# Altium schematic sheet Dig_Board1.SchDoc: CSN Detector V5
size A4; Author: RCP; DrawnBy: RCP; Address1: LIM-HGGM; Address3: RCP; DocumentNumber: 1; Revision: 1; SheetNumber: 1; SheetTotal: 2; PageSetup: Record=PageOptions|CenterHorizontal=True|CenterVertical=True|PrintScale=0.97|XCorrection=1.00|YCorrection=1.00|PrintKind=0|BorderSize=5000000|LeftOffset=0|BottomOffset=0|Orientation=2|PaperLength=2970|PaperWidth=2100|Scale=100|PaperSource=7|PrintQuality=600|MediaType=1|DitherType=10|PaperKind=A4|PrintScaleMode=1
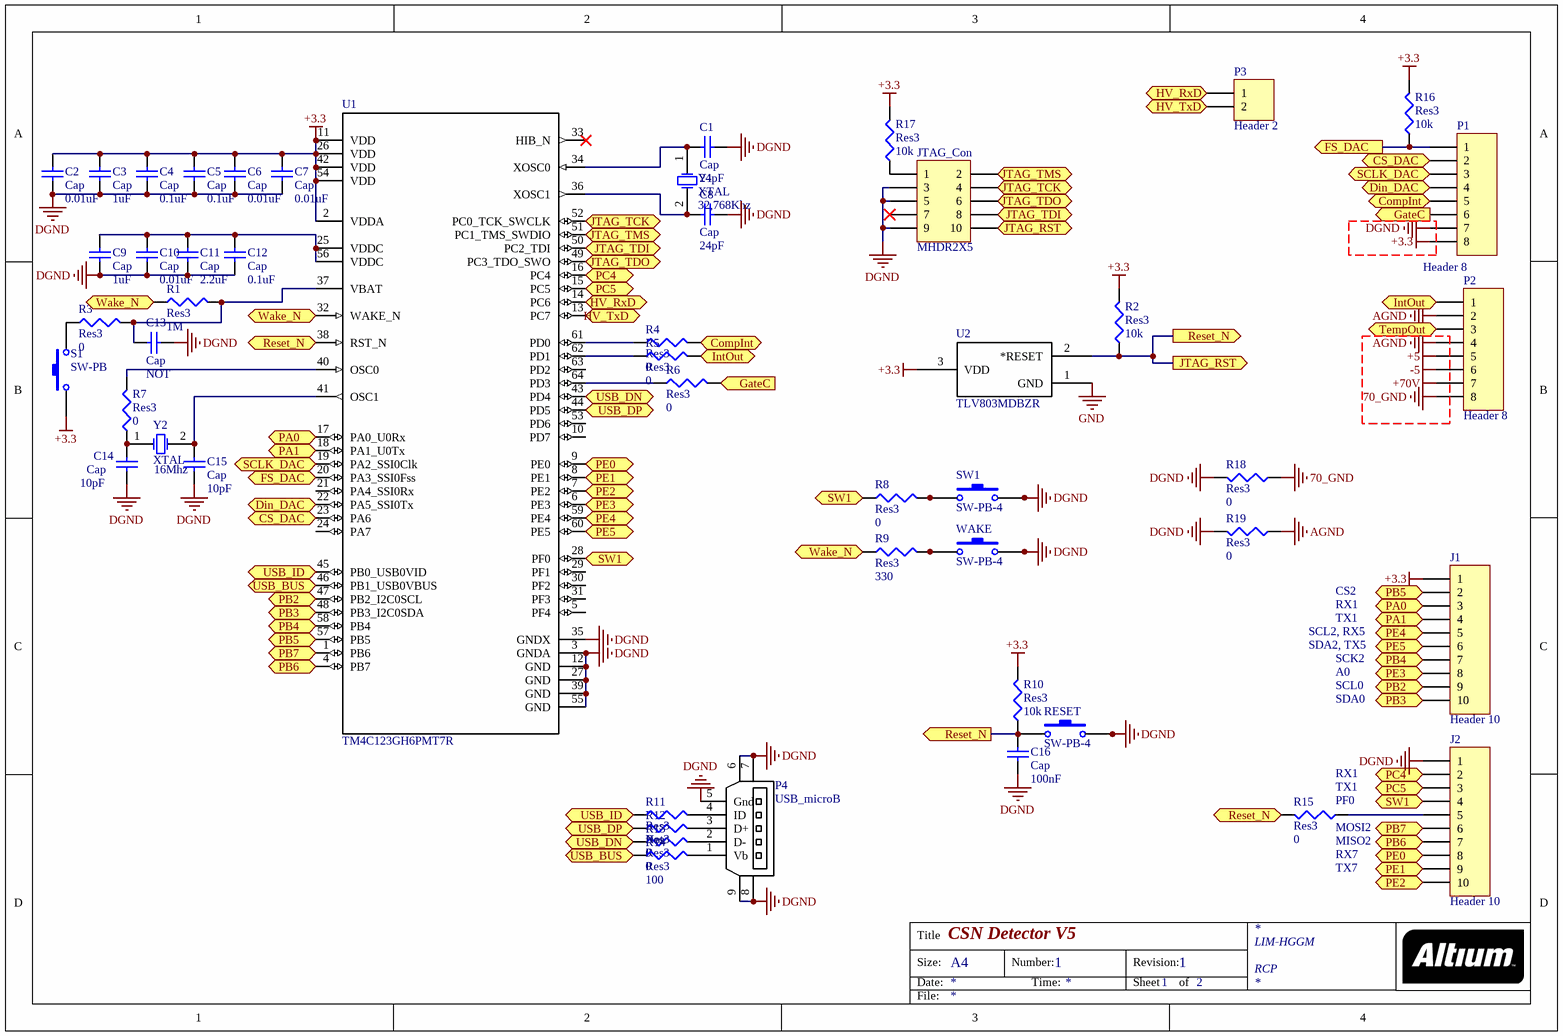
[diagram p0: Dig_Board1.SchDoc]

## Parts
C1  Cap  value 24pF  [1608[0603]]
C2  Cap  value 0.01uF  [1608[0603]]
C3  Cap  value 1uF  [1608[0603]]
C4  Cap  value 0.1uF  [1608[0603]]
C5  Cap  value 0.1uF  [1608[0603]]
C6  Cap  value 0.01uF  [1608[0603]]
C7  Cap  value 0.01uF  [1608[0603]]
C8  Cap  value 24pF  [1608[0603]]
C9  Cap  value 1uF  [1608[0603]]
C10  Cap  value 0.01uF  [1608[0603]]
C11  Cap  value 2.2uF  [1608[0603]]
C12  Cap  value 0.1uF  [1608[0603]]
C13  Cap  value NOT  [1608[0603]]
C14  Cap  value 10pF  [1608[0603]]
C15  Cap  value 10pF  [1608[0603]]
C16  Cap  value 100nF  [1608[0603]]
J1  Header 10  [HDR1X10]
J2  Header 10  [HDR1X10]
JTAG_Con  MHDR2X5  [MHDR2X5]
P1  Header 8  [HDR1X8]
P2  Header 8  [HDR1X8]
P3  Header 2  [HDR1X2]
P4  USB_microB  [USB_microB]
R1  Res3  value 1M  [J1-0603]
R2  Res3  value 10k  [J1-0603]
R3  Res3  value 0  [J1-0603]
R4  Res3  value 0  [J1-0603]
R5  Res3  value 0  [J1-0603]
R6  Res3  value 0  [J1-0603]
R7  Res3  value 0  [J1-0603]
R8  Res3  value 0  [J1-0603]
R9  Res3  value 330  [J1-0603]
R10  Res3  value 10k  [J1-0603]
R11  Res3  value Not  [J1-0603]
R12  Res3  value 0  [J1-0603]
R13  Res3  value 0  [J1-0603]
R14  Res3  value 100  [J1-0603]
R15  Res3  value 0  [J1-0603]
R16  Res3  value 10k  [J1-0603]
R17  Res3  value 10k  [J1-0603]
R18  Res3  value 0  [J1-0603]
R19  Res3  value 0  [J1-0603]
RESET  SW-PB-4  [Swtich 6x6 SMD]
S1  SW-PB  [SPST-2]
SW1  SW-PB-4  [Swtich 6x6 SMD]
U1  TM4C123GH6PMT7R  [PM0064A_M]
U2  TLV803MDBZR  [DBZ3]
WAKE  SW-PB-4  [Swtich 6x6 SMD]
Y1  XTAL  Freq: 32,768Khz  [Osc_ABS07]
Y2  XTAL  Freq: 16Mhz  [Osc_ABM8]

## Ports
CompInt (out), CS_DAC (in), CS_DAC (out), Din_DAC (in), Din_DAC (out), FS_DAC (in), FS_DAC (out), GateC (out), HV_RxD (in), HV_RxD (out), HV_TxD (in), HV_TxD (out), IntOut (out), JTAG_RST (in), JTAG_RST (out), JTAG_TCK (in), JTAG_TDI (in), JTAG_TDO (in), JTAG_TMS (in), PA0 (in), PA0 (out), PA1 (in), PA1 (out), PB2 (in), PB2 (out), PB3 (in), PB3 (out), PB4 (in), PB4 (out), PB5 (in), PB5 (out), PB6 (in), PB6 (out), PB7 (in), PB7 (out), PC4 (in), PC4 (out), PC5 (in), PC5 (out), PE0 (in), PE0 (out), PE1 (in), PE1 (out), PE2 (in), PE2 (out), PE3 (in), PE3 (out), PE4 (in), PE4 (out), PE5 (in), PE5 (out), Reset_N (out), SCLK_DAC (in), SCLK_DAC (out), SW1 (in), SW1 (out), TempOut (out), USB_BUS (out), USB_DN (in), USB_DN (out), USB_DP (in), USB_DP (out), USB_ID (out), Wake_N (out)

## Nets
70_GND: P2.8 R18.1
+3.3: C2.2 C3.2 C4.2 C5.2 C6.2 C7.2 J1.1 P1.8 R2.2 R10.2 R16.2 R17.2 S1.1 U1.2(VDDA) U1.11(VDD) U1.26(VDD) U1.42(VDD) U1.54(VDD) U2.3(VDD)
+5: P2.5
+70V: P2.7
-5: P2.6
AGND: P2.2 P2.4 R19.1
DGND: C1.1 C2.1 C3.1 C4.1 C5.1 C6.1 C7.1 C8.1 C9.1 C10.1 C11.1 C12.1 C13.1 C14.1 C15.1 C16.2 J2.1 JTAG_Con.3 JTAG_Con.5 JTAG_Con.9 P1.7 P4.5(Gnd) P4.6 P4.7 P4.8 P4.9 R18.2 R19.2 RESET.3 RESET.4 SW1.3 SW1.4 U1.3(GNDA) U1.12(GND) U1.27(GND) U1.35(GNDX) U1.39(GND) U1.55(GND) WAKE.3 WAKE.4
GND: U2.1(GND)
CompInt: P1.5 R4.2 ; port CompInt
CS_DAC: P1.2 U1.23(PA6) ; port CS_DAC
Din_DAC: P1.4 U1.22(PA5_SSI0Tx) ; port Din_DAC
FS_DAC: P1.1 R16.1 U1.20(PA3_SSI0Fss) ; port FS_DAC
GateC: P1.6 R6.2 ; port GateC
HV_RxD: P3.1 U1.14(PC6) ; port HV_RxD
HV_TxD: P3.2 U1.13(PC7) ; port HV_TxD
IntOut: P2.1 R5.2 ; port IntOut
JTAG_RST: C16.1 JTAG_Con.10 R2.1 R10.1 R15.2 RESET.1 RESET.2 U1.38(RST_N) U2.2(*RESET) ; port Reset_N, port JTAG_RST
JTAG_TCK: JTAG_Con.4 U1.52(PC0_TCK_SWCLK) ; port JTAG_TCK
JTAG_TDI: JTAG_Con.8 U1.50(PC2_TDI) ; port JTAG_TDI
JTAG_TDO: JTAG_Con.6 U1.49(PC3_TDO_SWO) ; port JTAG_TDO
JTAG_TMS: JTAG_Con.2 U1.51(PC1_TMS_SWDIO) ; port JTAG_TMS
PA0: J1.3 U1.17(PA0_U0Rx) ; port PA0
PA1: J1.4 U1.18(PA1_U0Tx) ; port PA1
PB2: J1.9 U1.47(PB2_I2C0SCL) ; port PB2
PB3: J1.10 U1.48(PB3_I2C0SDA) ; port PB3
PB4: J1.7 U1.58(PB4) ; port PB4
PB5: J1.2 U1.57(PB5) ; port PB5
PB6: J2.7 U1.4(PB7) ; port PB6
PB7: J2.6 U1.1(PB6) ; port PB7
PC4: J2.2 U1.16(PC4) ; port PC4
PC5: J2.3 U1.15(PC5) ; port PC5
PE0: J2.8 U1.9(PE0) ; port PE0
PE1: J2.9 U1.8(PE1) ; port PE1
PE2: J2.10 U1.7(PE2) ; port PE2
PE3: J1.8 U1.6(PE3) ; port PE3
PE4: J1.5 U1.59(PE4) ; port PE4
PE5: J1.6 U1.60(PE5) ; port PE5
SCLK_DAC: P1.3 U1.19(PA2_SSI0Clk) ; port SCLK_DAC
SW1: J2.4 R8.1 U1.28(PF0) ; port SW1
TempOut: P2.3 ; port TempOut
USB_BUS: R14.1 U1.46(PB1_USB0VBUS) ; port USB_BUS
USB_DN: R13.1 U1.43(PD4) ; port USB_DN
USB_DP: R12.1 U1.44(PD5) ; port USB_DP
USB_ID: R11.1 U1.45(PB0_USB0VID) ; port USB_ID
Wake_N: R1.1 R9.1 U1.32(WAKE_N) ; port Wake_N
NetC1_2: C1.2 U1.34(XOSC0) Y1.1(OSC1)
NetC8_2: C8.2 U1.36(XOSC1) Y1.2(OSC2)
NetC9_2: C9.2 C10.2 C11.2 C12.2 U1.25(VDDC) U1.56(VDDC)
NetC13_2: C13.2 R1.2 R3.2 U1.37(VBAT)
NetC14_2: C14.2 R7.1 Y2.1(OSC1)
NetC15_2: C15.2 U1.41(OSC1) Y2.2(OSC2)
NetJ2_5: J2.5 R15.1
NetJTAG_Con_1: JTAG_Con.1 R17.1
NetP4_1: P4.1(Vb) R14.2
NetP4_2: P4.2(D-) R13.2
NetP4_3: P4.3(D+) R12.2
NetP4_4: P4.4(ID) R11.2
NetR3_1: R3.1 S1.2
NetR4_1: R4.1 U1.61(PD0)
NetR5_1: R5.1 U1.62(PD1)
NetR6_1: R6.1 U1.64(PD3)
NetR7_2: R7.2 U1.40(OSC0)
NetR8_2: R8.2 SW1.1 SW1.2
NetR9_2: R9.2 WAKE.1 WAKE.2

Not connected (* = marked no-connect by the designer): JTAG_Con 7*; U1 5(PF4) 10(PD7) 21(PA4_SSI0Rx) 24(PA7) 29(PF1) 30(PF2) 31(PF3) 33(HIB_N)* 53(PD6) 63(PD2)

## Notes on the sheet
- SDA2, TX5
- SCL2, RX5
- CS2
- RX1
- TX1
- SCL0
- SDA0
- A0
- SCK2
- (near R15) TX1
- (near R15) RX1
- (near R15) MISO2
- (near R15) MOSI2
- (near R15) PF0
- (near R15) RX7
- (near R15) TX7
- Title
- Size:
- Date:
- A4
- Number:
- Time:
- Revision:
- Sheet
- of
- File:

## Library data of the parts
C1-C16 = Cap: Capacitor; Published: 8-Jun-2000; LatestRevisionDate: 17-Jul-2002; LatestRevisionNote: Re-released for DXP Platform.; PackageReference: RAD-0.3; Publisher: Altium Limited; PackageDescription: Radial Cap, Thru-Hole; 2 Leads; 0.3 in Pin Spacing
J1 J2 = Header 10: Header, 10-Pin; LatestRevisionDate: 17-Jul-2002; LatestRevisionNote: Re-released for DXP Platform.; Publisher: Altium Limited
JTAG_Con = MHDR2X5: Header, 5-Pin, Dual row; LatestRevisionDate: 17-Jul-2002; LatestRevisionNote: Re-released for DXP Platform.; Publisher: Altium Limited
P1 P2 = Header 8: Header, 8-Pin; LatestRevisionDate: 17-Jul-2002; LatestRevisionNote: Re-released for DXP Platform.; Publisher: Altium Limited
P3 = Header 2: Header, 2-Pin; LatestRevisionDate: 17-Jul-2002; LatestRevisionNote: Re-released for DXP Platform.; Publisher: Altium Limited
R1-R19 = Res3: Resistor; Published: 8-Jun-2000; LatestRevisionDate: 29-May-2009; LatestRevisionNote: IPC-7351 Footprint Added.; PackageReference: J1-0603; Publisher: Altium Limited; PackageDescription: Chip Resistor
RESET SW1 WAKE = SW-PB-4: Switch; Published: 24-Mar-1999; LatestRevisionDate: 17-Jul-2002; LatestRevisionNote: Re-released for DXP Platform.; PackageReference: SPST-2; Publisher: Altium Limited; PackageDescription: Switch; 2 Leads
S1 = SW-PB: Switch; Published: 24-Mar-1999; LatestRevisionDate: 17-Jul-2002; LatestRevisionNote: Re-released for DXP Platform.; PackageReference: SPST-2; Publisher: Altium Limited; PackageDescription: Switch; 2 Leads
U1 = TM4C123GH6PMT7R: Imported; PartNumber: TM4C123GH6PMTR; Manufacturer: Texas Instruments; CompType: IC; PIN_COUNT: 64; Application_BuildNumber: *; Alternate PartNumber: TM4C123GH6PMT; PackageReference: PM0064A; MountType: SMT; RoHS: Y; RefDes: RefDes; Type: DEV; Value: Value
U2 = TLV803MDBZR: Imported; Vendor: Texas Instruments; PACKAGE_DESIGNATOR: DBZ; PIN_COUNT: 3; FAMILY_NAME: SUPERVISOR AND RESET IC; INDUSTRY_STD_PKG_TYPE: SOT-23; 3D_Library_Name: TI_AllParts_2012-12-25; C: Copyright (C) 2015 Accelerated Designs. All rights reserved; Manufacturer_Part_Number: TLV803MDBZR; GENERIC_PART_NUMBER: TLV803M; Datasheet URL: http://www.ti.com/lit/gpn/TLV803M; Manufacturer: Texas Instruments; Copyright: Copyright (C) 2015 Accelerated Designs. All rights reserved; RefDes: RefDes; Type: DEV; Value: Value
Y1 Y2 = XTAL: Crystal Oscillator; Published: 8-Jun-2000; LatestRevisionDate: 17-Jul-2002; LatestRevisionNote: Re-released for DXP Platform.; PackageReference: R38; Publisher: Altium Limited; PackageDescription: Crystal, Thru-Hole; 2 Leads; Body 3.1 x 8.2 mm (Dia.xH)